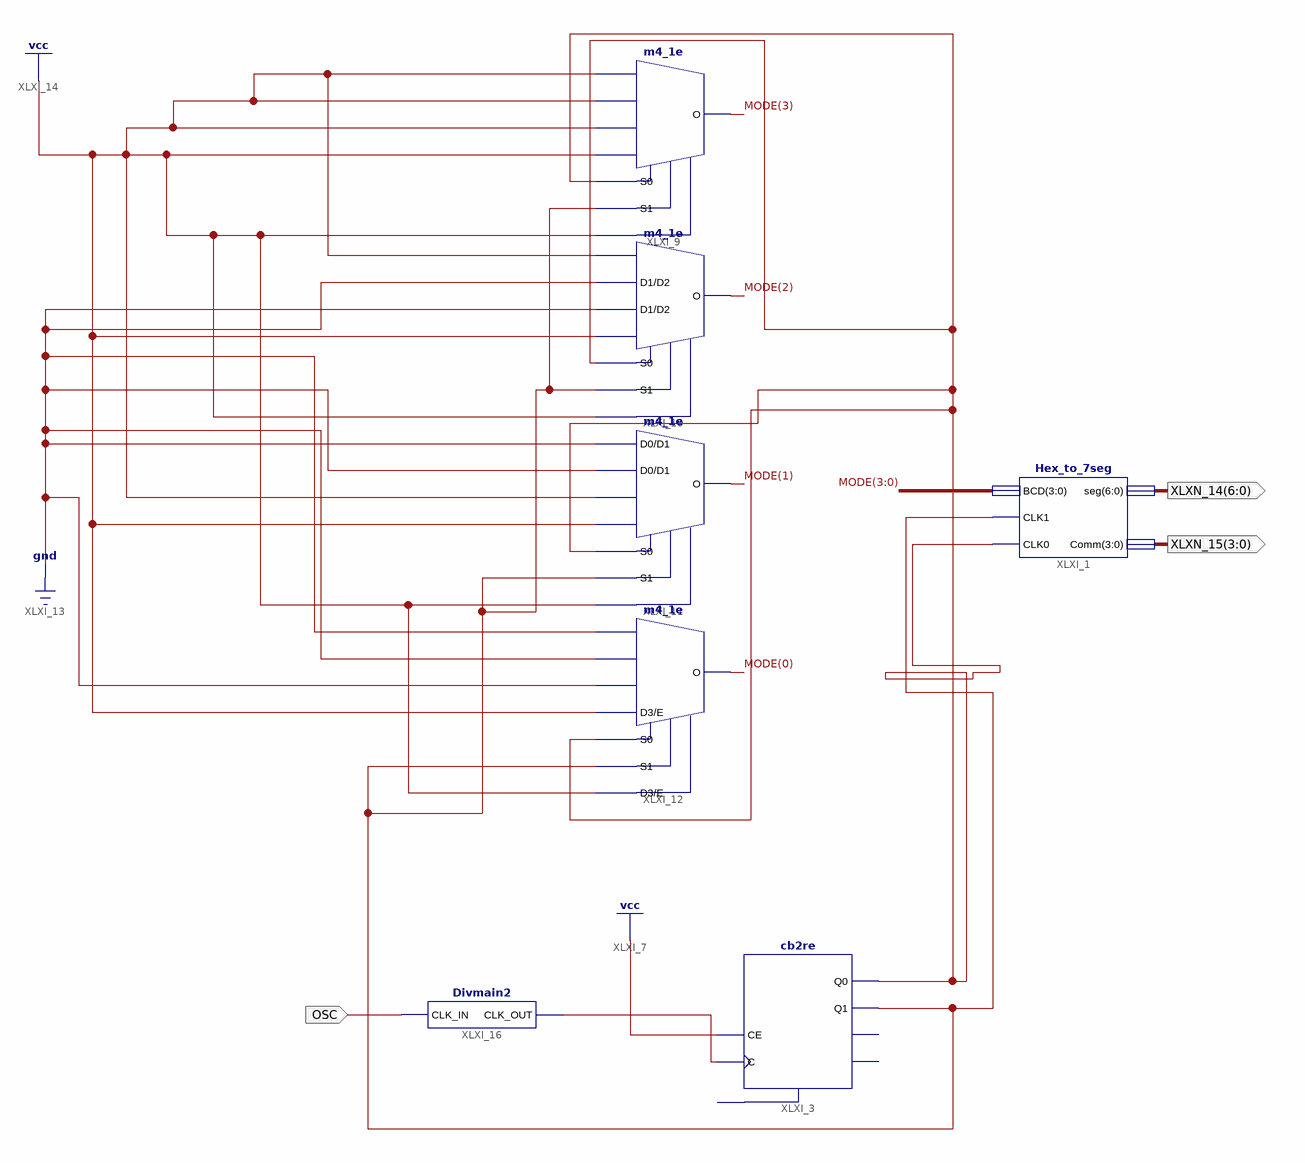
[diagram p0: schematic sheet 1]
// Xilinx ISE schematic main.sch (spartan6) as structural Verilog: 7 symbols, 3 ports
module main (
  input  OSC,
  output [6:0] XLXN_14,
  output [3:0] XLXN_15
);

  wire XLXN_4, XLXN_67, XLXN_69;
  wire [3:0] MODE;

  Hex_to_7seg XLXI_1 (.BCD(MODE), .CLK1(XLXN_69), .CLK0(XLXN_67), .seg(XLXN_14), .Comm(XLXN_15));
  cb2re XLXI_3 (.C(XLXN_4), .CE(1'b1), .Q0(XLXN_67), .Q1(XLXN_69));  // open: R, CEO, TC
  m4_1e XLXI_9 (.D0(1'b1), .D1(1'b1), .D2(1'b1), .D3(1'b1), .E(1'b1), .S0(XLXN_67), .S1(XLXN_69), .O(MODE[3]));
  m4_1e XLXI_10 (.D0(1'b1), .D1(1'b0), .D2(1'b0), .D3(1'b1), .E(1'b1), .S0(XLXN_67), .S1(XLXN_69), .O(MODE[2]));
  m4_1e XLXI_11 (.D0(1'b0), .D1(1'b0), .D2(1'b1), .D3(1'b1), .E(1'b1), .S0(XLXN_67), .S1(XLXN_69), .O(MODE[1]));
  m4_1e XLXI_12 (.D0(1'b0), .D1(1'b0), .D2(1'b0), .D3(1'b1), .E(1'b1), .S0(XLXN_67), .S1(XLXN_69), .O(MODE[0]));
  Divmain2 XLXI_16 (.CLK_IN(OSC), .CLK_OUT(XLXN_4));

  // Notes on the sheet:
  //   LOC on signal OSC = P123
  //   LOC on signal XLXN_14(6:0) = P27,P29,P32,P34,P35,P40,P41
  //   LOC on signal XLXN_15(3:0) = P30,P33,P43,P44
endmodule
